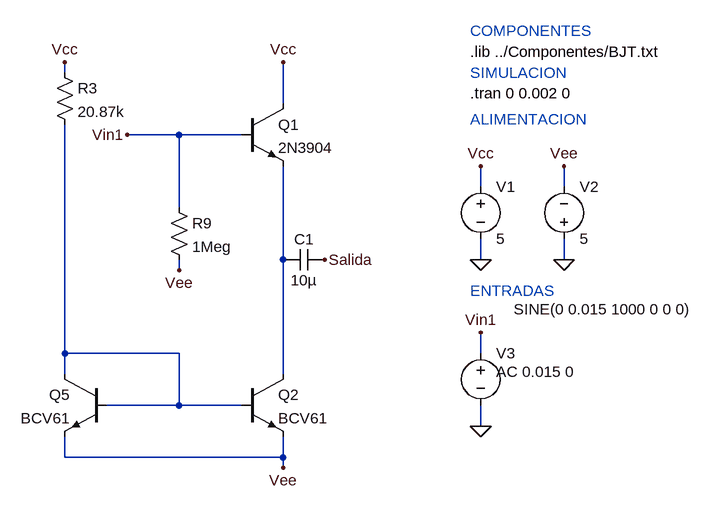
[diagram p0: schematic Emiter_follower_ind.asc]
Emiter_follower_ind.asc, the LTspice schematic file:
Version 4
SHEET 1 1252 872
WIRE 16 -176 16 -192
WIRE 352 -128 352 -192
WIRE 192 -80 112 -80
WIRE 288 -80 192 -80
WIRE 656 0 656 -32
WIRE 784 0 784 -32
WIRE 192 32 192 -80
WIRE 16 112 16 -96
WIRE 352 112 352 -32
WIRE 656 112 656 80
WIRE 784 112 784 80
WIRE 192 128 192 112
WIRE 16 256 16 112
WIRE 192 256 16 256
WIRE 656 256 656 224
WIRE 16 288 16 256
WIRE 352 288 352 112
WIRE 192 336 192 256
WIRE 192 336 80 336
WIRE 288 336 192 336
WIRE 656 368 656 336
WIRE 16 416 16 384
WIRE 352 416 352 384
WIRE 352 416 16 416
WIRE 352 432 352 416
FLAG 656 112 0
FLAG 784 112 0
FLAG 656 -32 Vcc
FLAG 784 -32 Vee
FLAG 656 368 0
FLAG 112 -80 Vin1
FLAG 656 224 Vin1
FLAG 352 432 Vee
FLAG 16 -192 Vcc
FLAG 352 -192 Vcc
FLAG 192 128 Vee
FLAG 416 112 Salida
DATAFLAG 352 112 "Ic(Q2)"
DATAFLAG 16 112 "I(R3)"
SYMBOL voltage 656 -16 R0
WINDOW 123 0 0 Left 2
WINDOW 39 0 0 Left 2
SYMATTR InstName V1
SYMATTR Value 5
SYMBOL voltage 784 96 M180
WINDOW 0 24 96 Left 2
WINDOW 3 24 16 Left 2
WINDOW 123 0 0 Left 2
WINDOW 39 0 0 Left 2
SYMATTR InstName V2
SYMATTR Value 5
SYMBOL voltage 656 240 R0
WINDOW 3 51 -52 Left 2
WINDOW 123 24 44 Left 2
WINDOW 39 63 45 Left 2
SYMATTR Value SINE(0 0.015 1000 0 0 0)
SYMATTR Value2 AC 0.015 0
SYMATTR InstName V3
SYMBOL npn 288 -128 R0
SYMATTR InstName Q1
SYMATTR Value 2N3904
SYMBOL npn 288 288 R0
SYMATTR InstName Q2
SYMATTR Value BCV61
SYMBOL npn 80 288 M0
SYMATTR InstName Q5
SYMATTR Value BCV61
SYMBOL res 0 -192 R0
SYMATTR InstName R3
SYMATTR Value 20.87k
SYMBOL res 176 16 R0
SYMATTR InstName R9
SYMATTR Value 1Meg
SYMBOL cap 416 96 R90
WINDOW 0 0 32 VBottom 2
WINDOW 3 32 32 VTop 2
SYMATTR InstName C1
SYMATTR Value 10µ
TEXT 640 -208 Left 2 !.lib ../Componentes/BJT.txt
TEXT 640 -240 Left 2 ;COMPONENTES
TEXT 640 -176 Left 2 ;SIMULACION
TEXT 640 -104 Left 2 ;ALIMENTACION
TEXT 640 160 Left 2 ;ENTRADAS
TEXT 640 -144 Left 2 !.tran 0 0.002 0

The netlist it stands for:
* Emiter_follower_ind.asc
V1 Vcc 0 5
V2 0 Vee 5
V3 Vin1 0 SINE(0 0.015 1000 0 0 0) AC 0.015 0
Q1 Vcc Vin1 N002 0 2N3904
Q2 N002 N001 Vee 0 BCV61
Q5 N001 N001 Vee 0 BCV61
R3 Vcc N001 20.87k
R9 Vin1 Vee 1Meg
C1 Salida N002 10µ
.model NPN NPN
.model PNP PNP
.lib standard.bjt
.lib ../Componentes/BJT.txt
* COMPONENTES
* SIMULACION
* ALIMENTACION
* ENTRADAS
.tran 0 0.002 0
.backanno
.end

* Results of the author's LTspice run, read from the files saved beside the schematic
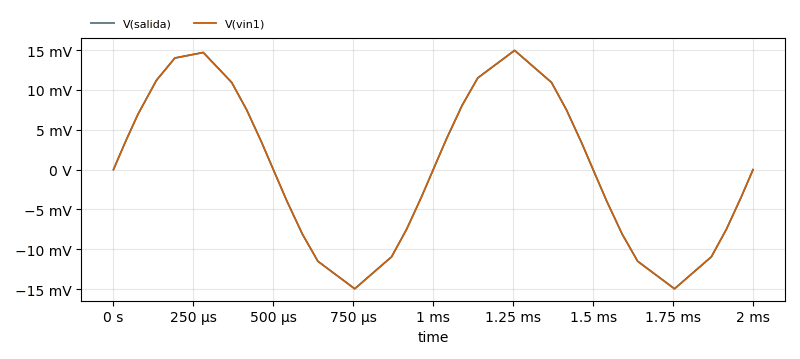
[diagram p1: Transient Analysis of Emiter_follower_ind.asc, plotted from the saved traces]
* Transient Analysis, 1 run:
*   V(salida): min -14.97 mV, max 14.95 mV, average 27.51 µV, rms 10.37 mV, last -6.349 µV
*   V(vin1): min -14.97 mV, max 14.97 mV, average 33.85 µV, rms 10.37 mV, last 0 V